# Altium project DM_V1.PrjPcb
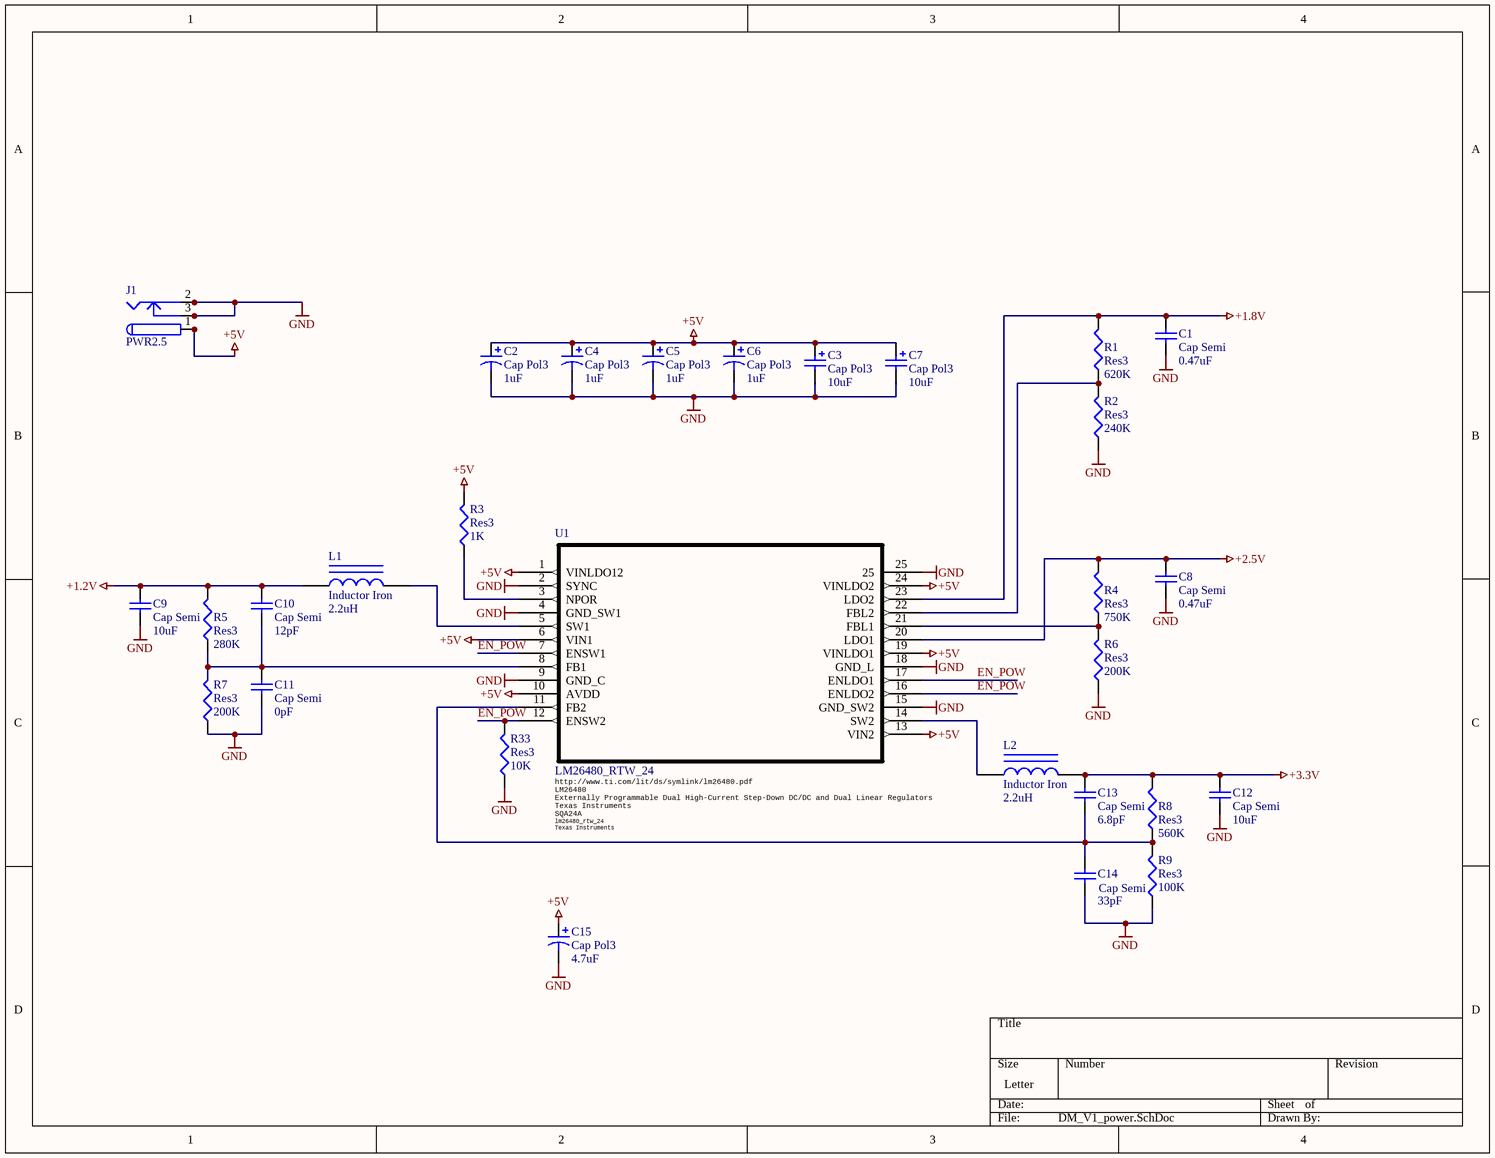
[diagram p0: DM_V1_power.SchDoc]
2 sheets, 36 parts. Net scope: global (net labels, ports and power ports of the same name join across sheets).
Board file: PCB1.PcbDoc
Sheets:
  DM_V1_power.SchDoc
  DM_V1_headers_misc.SchDoc

## Sheet DM_V1_power.SchDoc
size Letter; Author: Evgeny Kirshin; DrawnBy: Evgeny Kirshin

### Parts
C1  Cap Semi  value 0.47uF  [C0805]
C2  Cap Pol3  value 1uF  [C1206]
C3  Cap Pol3  value 10uF  [C1206]
C4  Cap Pol3  value 1uF  [C1206]
C5  Cap Pol3  value 1uF  [C1206]
C6  Cap Pol3  value 1uF  [C1206]
C7  Cap Pol3  value 10uF  [C1206]
C8  Cap Semi  value 0.47uF  [C0805]
C9  Cap Semi  value 10uF  [C0805]
C10  Cap Semi  value 12pF  [C0805]
C11  Cap Semi  value 0pF  [C0805]
C12  Cap Semi  value 10uF  [C0805]
C13  Cap Semi  value 6.8pF  [C0805]
C14  Cap Semi  value 33pF  [C0805]
C15  Cap Pol3  value 4.7uF  [C1206]
J1  PWR2.5  [KLD-0202]
L1  Inductor Iron  value 2.2uH  [Coil inductor]
L2  Inductor Iron  value 2.2uH  [Coil inductor]
R1  Res3  value 620K  [J1-0603]
R2  Res3  value 240K  [J1-0603]
R3  Res3  value 1K  [J1-0603]
R4  Res3  value 750K  [J1-0603]
R5  Res3  value 280K  [J1-0603]
R6  Res3  value 200K  [J1-0603]
R7  Res3  value 200K  [J1-0603]
R8  Res3  value 560K  [J1-0603]
R9  Res3  value 100K  [J1-0603]
R33  Res3  value 10K  [J1-0603]
U1  LM26480_RTW_24  basePN: LM26480  DESCRIPTION: Externally Programmable Dual High-Current Step-Down DC/DC and Dual Linear Regulators  Manufacturer: Texas Instruments  [SQA24A]

### Nets
+1.2V: C9.2 C10.2 L1.1 R5.2
+1.8V: C1.2 R1.2 U1.23(LDO2)
+2.5V: C8.2 R4.2 U1.20(LDO1)
+3.3V: C12.2 C13.2 L2.2 R8.2
+5V: C2.1 C3.1 C4.1 C5.1 C6.1 C7.1 C15.1 J1.1 J1.1A J1.1B R3.2 U1.1(VINLDO12) U1.6(VIN1) U1.10(AVDD) U1.13(VIN2) U1.19(VINLDO1) U1.24(VINLDO2)
GND: C1.1 C2.2 C3.2 C4.2 C5.2 C6.2 C7.2 C8.1 C9.1 C11.1 C12.1 C14.1 C15.2 J1.2 J1.2A J1.2B J1.3 J1.3A J1.3B R2.1 R6.1 R7.1 R9.1 R33.1 U1.2(SYNC) U1.4(GND_SW1) U1.9(GND_C) U1.15(GND_SW2) U1.18(GND_L) U1.25
EN_POW: R33.2 U1.7(ENSW1) U1.12(ENSW2) U1.16(ENLDO2) U1.17(ENLDO1)
NetC10_1: C10.1 C11.2 R5.1 R7.2 U1.8(FB1)
NetC13_1: C13.1 C14.2 R8.1 R9.2 U1.11(FB2)
NetL1_2: L1.2 U1.5(SW1)
NetL2_1: L2.1 U1.14(SW2)
NetR1_1: R1.1 R2.2 U1.22(FBL2)
NetR3_1: R3.1 U1.3(NPOR)
NetR4_1: R4.1 R6.2 U1.21(FBL1)

### Library data of the parts
C1 C8-C14 = Cap Semi: Capacitor (Semiconductor SIM Model); Published: 8-Jun-2000; LatestRevisionDate: 29-May-2009; LatestRevisionNote: IPC-7351 Footprint Added.; PackageReference: C1206; Publisher: Altium Limited; PackageDescription: Chip Capacitor
C2-C7 C15 = Cap Pol3: Polarized Capacitor (Surface Mount); Published: 8-Jun-2000; LatestRevisionDate: 29-May-2009; LatestRevisionNote: IPC-7351 Footprint Added.; PackageReference: C0805; Publisher: Altium Limited; PackageDescription: Chip Capacitor
J1 = PWR2.5: Low Voltage Power Supply Connector; Published: 17-Dec-2003; DatasheetDocument: 09-May-2002; Publisher: Altium Limited; ComponentLink1Description: Manufacturer Link; ComponentLink1URL: http://domino.kycon.com/internet/Products.html
L1 L2 = Inductor Iron: Magnetic-Core Inductor; Published: 24-Mar-1999; LatestRevisionDate: 17-Jul-2002; LatestRevisionNote: Re-released for DXP Platform.; PackageReference: AXIAL-0.9; Publisher: Altium Limited; PackageDescription: Axial Device, Thru-Hole; 2 Leads; 0.9 in Pin Spacing
R1-R9 R33 = Res3: Resistor; Published: 8-Jun-2000; LatestRevisionDate: 29-May-2009; LatestRevisionNote: IPC-7351 Footprint Added.; PackageReference: J1-0603; Publisher: Altium Limited; PackageDescription: Chip Resistor
U1 = LM26480_RTW_24: Imported; DatasheetURL: http://www.ti.com/lit/ds/symlink/lm26480.pdf; NSC_PackageReference: SQA24A; MANUFACTURER_PART_NUMBER: lm26480_rtw_24; VENDOR: Texas Instruments

## Sheet DM_V1_headers_misc.SchDoc
size Letter
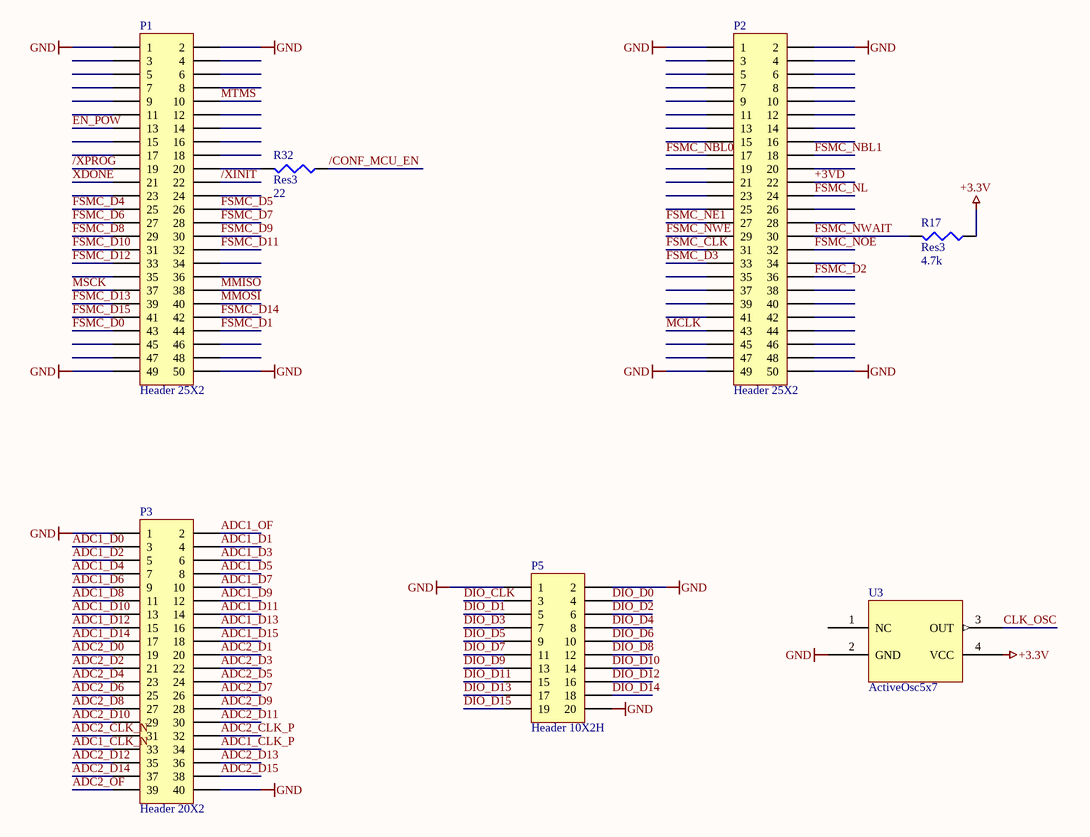
[diagram p1: DM_V1_headers_misc.SchDoc]

### Parts
P1  Header 25X2  [HDR2X25]
P2  Header 25X2  [HDR2X25]
P3  Header 20X2  [HDR2X20]
P5  Header 10X2H  [HDR2X10H]
R17  Res3  value 4.7k  [J1-0603]
R32  Res3  value 22  [J1-0603]
U3  ActiveOsc5x7  [ACT_OSC]

### Nets
+3.3V: R17.1 U3.4(VCC)
GND: P1.1 P1.2 P1.49 P1.50 P2.1 P2.2 P2.49 P2.50 P3.1 P3.40 P5.1 P5.2 P5.20 U3.2(GND)
+3VD: P2.22
/CONF_MCU_EN: R32.1
/XINIT: P1.22
/XPROG: P1.19
ADC1_CLK_N: P3.33
ADC1_CLK_P: P3.34
ADC1_D0: P3.3
ADC1_D1: P3.4
ADC1_D2: P3.5
ADC1_D3: P3.6
ADC1_D4: P3.7
ADC1_D5: P3.8
ADC1_D6: P3.9
ADC1_D7: P3.10
ADC1_D8: P3.11
ADC1_D9: P3.12
ADC1_D10: P3.13
ADC1_D11: P3.14
ADC1_D12: P3.15
ADC1_D13: P3.16
ADC1_D14: P3.17
ADC1_D15: P3.18
ADC1_OF: P3.2
ADC2_CLK_N: P3.31
ADC2_CLK_P: P3.32
ADC2_D0: P3.19
ADC2_D1: P3.20
ADC2_D2: P3.21
ADC2_D3: P3.22
ADC2_D4: P3.23
ADC2_D5: P3.24
ADC2_D6: P3.25
ADC2_D7: P3.26
ADC2_D8: P3.27
ADC2_D9: P3.28
ADC2_D10: P3.29
ADC2_D11: P3.30
ADC2_D12: P3.35
ADC2_D13: P3.36
ADC2_D14: P3.37
ADC2_D15: P3.38
ADC2_OF: P3.39
CLK_OSC: U3.3(OUT)
DIO_CLK: P5.3
DIO_D0: P5.4
DIO_D1: P5.5
DIO_D2: P5.6
DIO_D3: P5.7
DIO_D4: P5.8
DIO_D5: P5.9
DIO_D6: P5.10
DIO_D7: P5.11
DIO_D8: P5.12
DIO_D9: P5.13
DIO_D10: P5.14
DIO_D11: P5.15
DIO_D12: P5.16
DIO_D13: P5.17
DIO_D14: P5.18
DIO_D15: P5.19
EN_POW: P1.13
FSMC_CLK: P2.31
FSMC_D0: P1.43
FSMC_D1: P1.44
FSMC_D2: P2.36
FSMC_D3: P2.33
FSMC_D4: P1.25
FSMC_D5: P1.26
FSMC_D6: P1.27
FSMC_D7: P1.28
FSMC_D8: P1.29
FSMC_D9: P1.30
FSMC_D10: P1.31
FSMC_D11: P1.32
FSMC_D12: P1.33
FSMC_D13: P1.39
FSMC_D14: P1.42
FSMC_D15: P1.41
FSMC_NBL0: P2.17
FSMC_NBL1: P2.18
FSMC_NE1: P2.27
FSMC_NL: P2.24
FSMC_NOE: P2.32
FSMC_NWAIT: P2.30 R17.2
FSMC_NWE: P2.29
MCLK: P2.43
MMISO: P1.38
MMOSI: P1.40
MSCK: P1.37
MTMS: P1.10
XDONE: P1.21
NetP1_20: P1.20 R32.2

Not connected (* = marked no-connect by the designer): P1 3 4 5 6 7 8 9 11 12 14 15 16 17 18 23 24 34 35 36 45 46 47 48; P2 3 4 5 6 7 8 9 10 11 12 13 14 15 16 19 20 21 23 25 26 28 34 35 37 38 39 40 41 42 44 45 46 47 48; U3 1(NC)

### Library data of the parts
P1 P2 = Header 25X2: Header, 25-Pin, Dual row; LatestRevisionDate: 17-Jul-2002; LatestRevisionNote: Re-released for DXP Platform.; Publisher: Altium Limited
P3 = Header 20X2: Header, 20-Pin, Dual row; LatestRevisionDate: 17-Jul-2002; LatestRevisionNote: Re-released for DXP Platform.; Publisher: Altium Limited
P5 = Header 10X2H: Header, 10-Pin, Dual row, Right Angle; LatestRevisionDate: 17-Jul-2002; LatestRevisionNote: Re-released for DXP Platform.; Publisher: Altium Limited
R17 R32 = Res3: Resistor; Published: 8-Jun-2000; LatestRevisionDate: 29-May-2009; LatestRevisionNote: IPC-7351 Footprint Added.; PackageReference: J1-0603; Publisher: Altium Limited; PackageDescription: Chip Resistor

## Nets that join several sheets
+3.3V: DM_V1_power (C12.2 C13.2 L2.2 R8.2), DM_V1_headers_misc (R17.1 U3.4)
GND: DM_V1_power (30 pins), DM_V1_headers_misc (14 pins)
EN_POW: DM_V1_power (5 pins), DM_V1_headers_misc (P1.13)